# EAGLE design KSZ8851 (EAGLE 7.5.0)
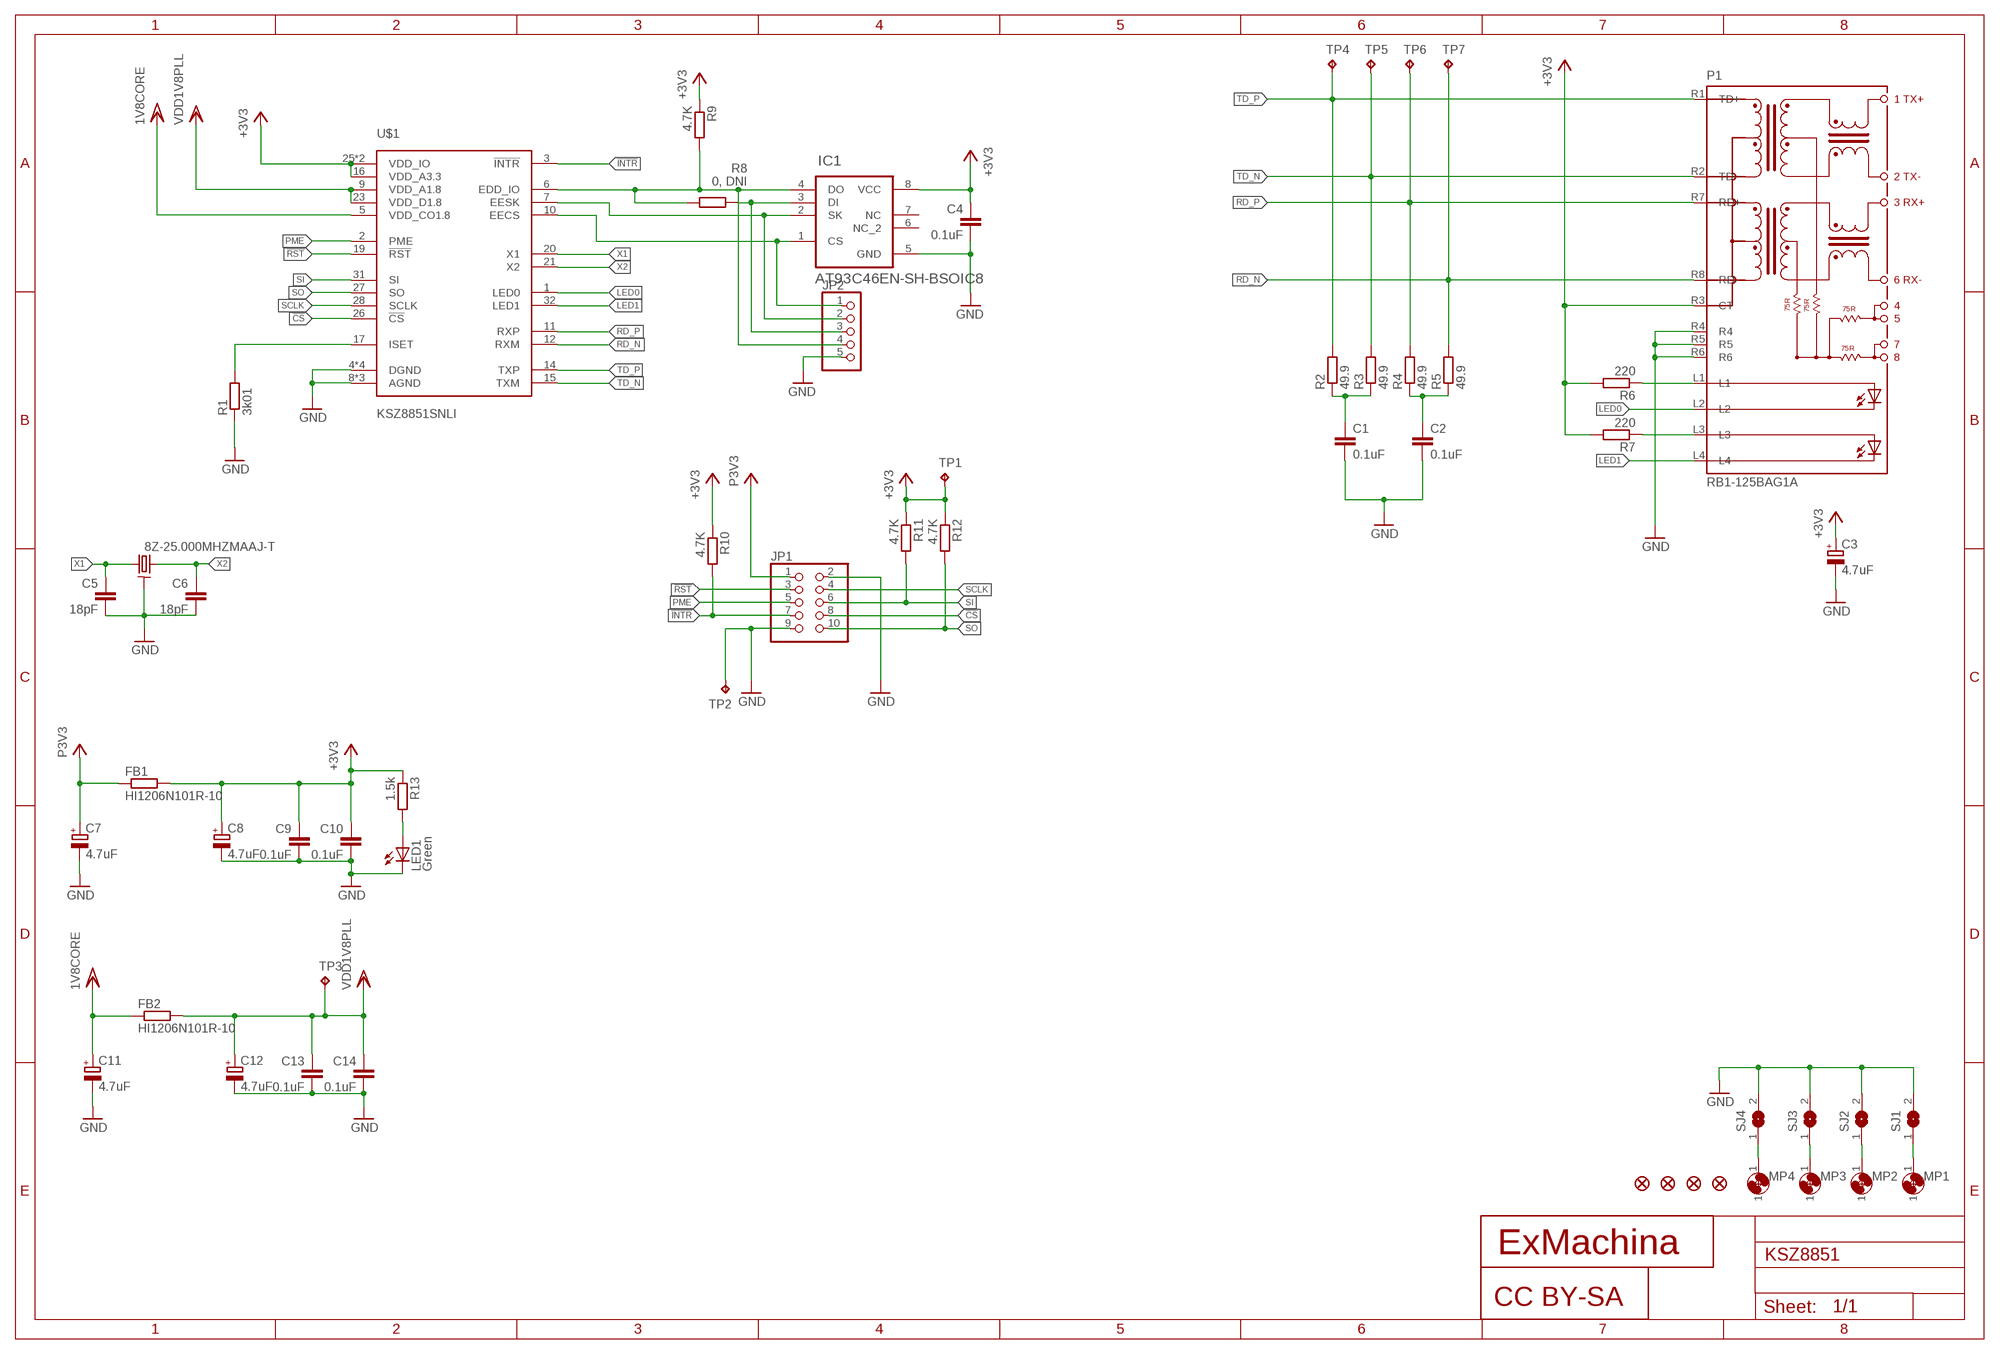
[diagram p0: schematic, sheet 1]

## Parts
-25.000MHZMAAJ-T1  8Z-25.000MHZMAAJ-T  [SMD2.5X2]
C1  0.1uF  C-EUC0603  [C0603]
C2  0.1uF  C-EUC0603  [C0603]
C3  4.7uF  CPOL-EUCT3216  [CT3216]
C4  0.1uF  C-EUC0603  [C0603]
C5  18pF  C-EUC0603  [C0603]
C6  18pF  C-EUC0603  [C0603]
C7  4.7uF  CPOL-EUCT3216  [CT3216]
C8  4.7uF  CPOL-EUCT3216  [CT3216]
C9  0.1uF  C-EUC0603  [C0603]
C10  0.1uF  C-EUC0603  [C0603]
C11  4.7uF  CPOL-EUCT3216  [CT3216]
C12  4.7uF  CPOL-EUCT3216  [CT3216]
C13  0.1uF  C-EUC0603  [C0603]
C14  0.1uF  C-EUC0603  [C0603]
FB1  HI1206N101R-10  [1206]
FB2  HI1206N101R-10  [1206]
IC1  AT93C46EN-SH-BSOIC8  [SOIC8]
JP1  PINHD-2X5  [2X05]
JP2  PINHD-1X55X2MM  [1_05X2MM]
JP3  FIDUCIAL1X2  [FIDUCIAL-1X2]
JP4  FIDUCIAL1X2  [FIDUCIAL-1X2]
JP5  FIDUCIAL1X2  [FIDUCIAL-1X2]
JP6  FIDUCIAL1X2  [FIDUCIAL-1X2]
LED1  Green  LEDSML0603  [SML0603]
MP1  MOUNT-PAD2.5  [P2.5]
MP2  MOUNT-PAD2.5  [P2.5]
MP3  MOUNT-PAD2.5  [P2.5]
MP4  MOUNT-PAD2.5  [P2.5]
P1  RB1-125BAG1A  [WIZNET_RB1-125BAG1A]
R1  3k01  R-EU_R0603  [R0603]
R2  49.9  R-EU_R0603  [R0603]
R3  49.9  R-EU_R0603  [R0603]
R4  49.9  R-EU_R0603  [R0603]
R5  49.9  R-EU_R0603  [R0603]
R6  220  R-EU_R0603  [R0603]
R7  220  R-EU_R0603  [R0603]
R8  0, DNI  R-EU_R0603  [R0603]
R9  4.7K  R-EU_R0603  [R0603]
R10  4.7K  R-EU_R0603  [R0603]
R11  4.7K  R-EU_R0603  [R0603]
R12  4.7K  R-EU_R0603  [R0603]
R13  1.5k  R-EU_R0603  [R0603]
SJ1  SJ  [SJ]
SJ2  SJ  [SJ]
SJ3  SJ  [SJ]
SJ4  SJ  [SJ]
TP1  TPB2,54  [B2,54]
TP2  TPB2,54  [B2,54]
TP3  TPB2,54  [B2,54]
TP4  TPB1,27  [B1,27]
TP5  TPB1,27  [B1,27]
TP6  TPB1,27  [B1,27]
TP7  TPB1,27  [B1,27]
U$1  KSZ8851SNLI  [QFN50P500X500X85-32L]
U$2  EXMACHINA-LOGO-NAME  [EXM-LOGO-BASELINE]
U$3  CC-BY-SA  [CC-BY-SA]

## Nets
1: MP1.1 MP2.1 MP3.1 MP4.1 SJ1.1 SJ2.1 SJ3.1 SJ4.1
!CS: JP1.8 U$1.26(!CS)
!INTR: JP1.7 R10.2 U$1.3(!INTR)
!RST: JP1.3 U$1.19(!RST)
+3V3: C3.+ C4.1 C8.+ C9.1 C10.1 FB1.2 IC1.8(VCC) P1.R3(CT) R6.2 R7.2 R9.1 R10.1 R11.1 R12.1 R13.1 TP1.TP U$1.16(VDD_A3.3) U$1.25(VDD_IO) U$1.30(VDD_IO)
EECS: IC1.1(CS) JP2.1 U$1.10(EECS)
EEDIO: IC1.4(DO) JP2.4 R8.2 R9.2 U$1.6(EDD_IO)
EESK: IC1.2(SK) JP2.2 U$1.7(EESK)
GND: -25.000MHZMAAJ-T1.2 -25.000MHZMAAJ-T1.4 C1.2 C2.2 C3.- C4.2 C5.2 C6.2 C7.- C8.- C9.2 C10.2 C11.- C12.- C13.2 C14.2 IC1.5(GND) JP1.2 JP1.9 JP2.5 LED1.C P1.R4 P1.R5 P1.R6 R1.1 SJ1.2 SJ2.2 SJ3.2 SJ4.2 TP2.TP U$1.4(DGND) U$1.8(AGND) U$1.13(AGND) U$1.18(AGND) U$1.22(DGND) U$1.24(DGND) U$1.29(DGND)
LED0: P1.L2 U$1.1(LED0)
LED1: P1.L4 U$1.32(LED1)
N$1: R1.2 U$1.17(ISET)
N$2: P1.L3 R7.1
N$3: P1.L1 R6.1
N$4: LED1.A R13.2
N$7: C1.1 R2.1 R3.1
N$8: C2.1 R4.1 R5.1
N$9: IC1.3(DI) JP2.3 R8.1
PME: JP1.5 U$1.2(PME)
RD_N: P1.R8(RD-) R5.2 TP7.TP U$1.12(RXM)
RD_P: P1.R7(RD+) R4.2 TP6.TP U$1.11(RXP)
SCLK: JP1.4 U$1.28(SCLK)
SI: JP1.6 R11.2 U$1.31(SI)
SO: JP1.10 R12.2 U$1.27(SO)
TD_N: P1.R2(TD-) R3.2 TP5.TP U$1.15(TXM)
TD_P: P1.R1(TD+) R2.2 TP4.TP U$1.14(TXP)
VCC: C7.+ FB1.1 JP1.1 ; supply symbol labelled P3V3
VCC/2: C11.+ FB2.1 U$1.5(VDD_CO1.8) ; supply symbol labelled 1V8CORE
VDD: C12.+ C13.1 C14.1 FB2.2 TP3.TP U$1.9(VDD_A1.8) U$1.23(VDD_D1.8) ; supply symbol labelled VDD1V8PLL
X1: -25.000MHZMAAJ-T1.1 C5.1 U$1.20(X1)
X2: -25.000MHZMAAJ-T1.3 C6.1 U$1.21(X2)
Unconnected: IC1.6(NC_2) IC1.7(NC)

## Library data of the parts
-25.000MHZMAAJ-T1 = crystal:8Z; MPN: 8Z-25.000MAAJ-T; OC_NEWARK: 84R5794
C1 C2 C4 C9 C10 C13 C14 = rcl:C-EU: CAPACITOR, European symbol; MPN: MC0603B104K160CT; OC_NEWARK: 06R4923
C3 C7 C8 C11 C12 = rcl:CPOL-EU: POLARIZED CAPACITOR, European symbol; MPN: MCCTA475M010; OC_NEWARK: 01M8221
C5 C6 = rcl:C-EU: CAPACITOR, European symbol; MPN: MC0603N180J500CT; OC_NEWARK: 06R5138
FB1 FB2 = emi_filter:HI?N101R-10; MC: LAIRD TECHNOLOGIES; MPN: HI1206N101R-10; OC_FARNELL: 2292367; OC_NEWARK: 66W8861
IC1 = atmel:AT93C46EN-SH-B: Three-wire Serial EEPROM,SOIC-8; MPN: AT93C46EN-SH-T; OC_NEWARK: 68T5247
JP1 = pinhead:PINHD-2X5: PIN HEADER; MPN: M20-9980546; OC_NEWARK: 84K8708
JP2 = pinhead:PINHD-1X5: PIN HEADER; MF: FARNELL; MPN: M22-2010505; OC_NEWARK: 08WX6673
JP3-JP6 = SparkFun:FIDUCIAL: Fiducial Alignment Points Various fiducial points for machine vision alignment.; OC_NEWARK: unknown
LED1 = led:LED: LED OSRAM: - CHIPLED LG R971, LG N971, LY N971, LG Q971, LY Q971, LO R971, LY R971 LH N974, LH R974 LS Q976, LO Q976, LY Q976 LO Q996 - Hyper CHIPLED LW Q18S LB Q993, LB Q99A, LB R99A - SideLED LS A670, LO A670, LY A670, LG A670, LP A670 LB A673, LV A673, LT A673, LW A673 LH A674 LY A675 LS A676, LA A676, LO A676, LY A676, LW A676 LS A679, LY A679, LG A679 - Hyper Micro SIDELED® LS Y876, LA Y876, LO Y876, LY Y876 LT Y87S - SmartLED LW L88C, LW L88S LB L89C, LB L89S, LG L890 LS L89K, LO L89K, LY L89K LS L896, LA L896, LO L896, LY L896 - TOPLED LS T670, LO T670, LY T670, LG T670, LP T670 LSG T670, LSP T670, LSY T670, LOP T670, LYG T670 LG T671, LOG T671, LSG T671 LB T673, LV T673, LT T673, LW T673 LH T674 LS T676, LA T676, LO T676, LY T676, LB T676, LH T676, LSB T676, LW T676 LB T67C, LV T67C, LT T67C, LS T67K, LO T67K, LY T67K, LW E67C LS E67B, LA E67B, LO E67B, LY E67B, LB E67C, LV E67C, LT E67C LW T67C LS T679, LY T679, LG T679 LS T770, LO T770, LY T770, LG T770, LP T770 LB T773, LV T773, LT T773, LW T773 LH T774 LS E675, LA E675, LY E675, LS T675 LS T776, LA T776, LO T776, LY T776, LB T776 LHGB T686 LT T68C, LB T68C - Hyper Mini TOPLED® LB M676 - Mini TOPLED Santana® LG M470 LS M47K, LO M47K, LY M47K Source: http://www.osram.convergy.de LUXEON: - LUMILED® LXK2-PW12-R00, LXK2-PW12-S00, LXK2-PW14-U00, LXK2-PW14-V00 LXK2-PM12-R00, LXK2-PM12-S00, LXK2-PM14-U00 LXK2-PE12-Q00, LXK2-PE12-R00, LXK2-PE12-S00, LXK2-PE14-T00, LXK2-PE14-U00 LXK2-PB12-K00, LXK2-PB12-L00, LXK2-PB12-M00, LXK2-PB14-N00, LXK2-PB14-P00, LXK2-PB14-Q00 LXK2-PR12-L00, LXK2-PR12-M00, LXK2-PR14-Q00, LXK2-PR14-R00 LXK2-PD12-Q00, LXK2-PD12-R00, LXK2-PD12-S00 LXK2-PH12-R00, LXK2-PH12-S00 LXK2-PL12-P00, LXK2-PL12-Q00, LXK2-PL12-R00 Source: www.luxeon.com KINGBRIGHT: KA-3528ASYC Source: www.kingbright.com; MPN: OVS-0604; OC_NEWARK: 15R2206
MP1-MP4 = holes:MOUNT-PAD: MOUNTING HOLE with drill center marker; OC_NEWARK: unknown
P1 = con-wiznet:RB1-125BAG1A: Accessory RJ-45 With Transformer Connector - UDE; OC_NEWARK: unknown
R1 = rcl:R-EU_: RESISTOR, European symbol; MPN: MC0063W060313K01; OC_NEWARK: 94W5780
R2-R5 = rcl:R-EU_: RESISTOR, European symbol; MPN: MC0603SAF499JT5E; OC_NEWARK: 79M5983
R6 R7 = rcl:R-EU_: RESISTOR, European symbol; MF: Multicomp Passives; MPN: MC0063W06031220R; OC_NEWARK: 58K4526
R8 = rcl:R-EU_: RESISTOR, European symbol; MF: Multicomp Passives; MPN: MC0603WG00000T5E-TC; OC_NEWARK: 58K4684
R9-R12 = rcl:R-EU_: RESISTOR, European symbol; MF: Multicomp Passives; MPN: MC0063W060314K7; OC_NEWARK: 58K4608
R13 = rcl:R-EU_: RESISTOR, European symbol; MPN: MCMR06X1501FTL; OC_NEWARK: 86T3542
SJ1-SJ4 = jumper:SJ: SMD solder JUMPER; OC_NEWARK: unknown
TP1-TP7 = testpad:TP: Test pad; OC_NEWARK: unknown
U$1 = Micrel_By_element14_Batch_1:KSZ8851SNL; MPN: KSZ8851SNLI-TR; OC_NEWARK: 72Y5310
U$2 = exmachina:EXMACHINA-LOGO; OC_NEWARK: unknown
U$3 = cc-by-sa:CC-BY-SA; OC_NEWARK: unknown

## Board
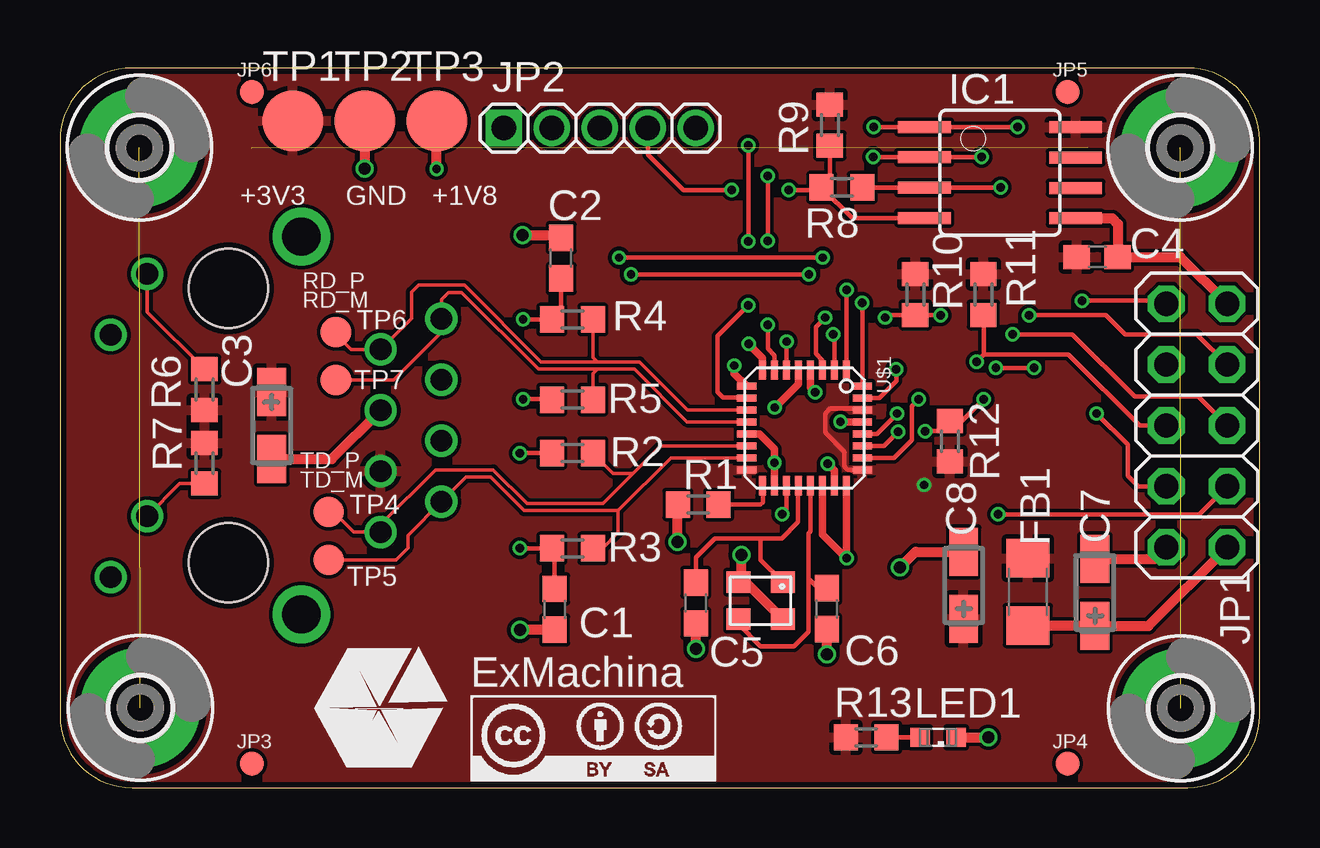
[diagram p1: board, top side]
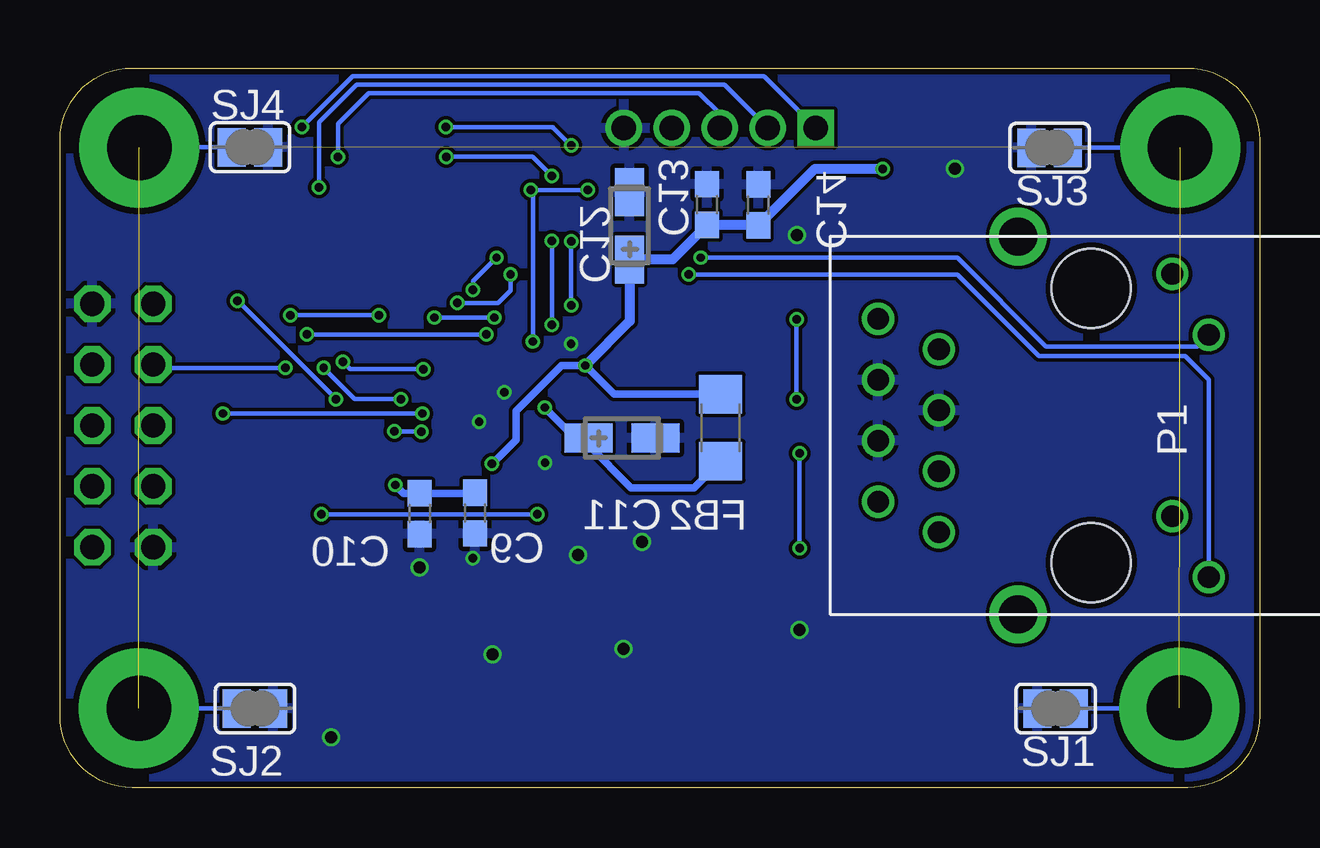
[diagram p2: board, bottom side, seen from below]

Size 50 x 30 mm. Coordinates in mm from the lower left corner, seen from the top.
Outline: 0,27 0,3 arc90 3,0 47,0 arc90 50,3 50,27 arc90 47,30 3,30 arc90 0,27
Copper layers (1*16): Top 0.018mm / dielectric 1.55mm / Bottom 0.018mm
Design rules "eC_2Layer_PClass6_BaseCopperO18_eCDefault *": minimum track width 0.15mm, minimum drill 0.35mm, track to track 0.15mm, track to pad 0.15mm, pad to pad 0.15mm, via to via 0.15mm, smd to smd 0mil, copper to edge 0.25mm, drill to drill 0.35mm, minimum pad ring 0.175mm, minimum via ring 0.125mm, stop-mask expansion 0mil, vias tented up to drill 0.45mm, thermal gap 0.2mm

### Footprints (pad centres in the part's own frame; a part is rotated, then mirrored left to right if it is on the bottom)
SMD2.5X2 = smd 1 x 0.9: 1 -0.925,-0.775; 2 0.925,-0.775; 3 0.925,0.775; 4 -0.925,0.775
C0603 = smd 1.1 x 1: 1 -0.85,0; 2 0.85,0
CT3216 = smd 2 x 1.2: + -1.4,0; - 1.4,0
1206 = smd 1.6 x 1.8: 1 -1.451,0.025; 2 1.349,0.025
SOIC8 = smd 0.5 x 2.2: 1 -1.905,-3.154; 2 -0.645,-3.154; 3 0.625,-3.154; 4 1.895,-3.154; 5 1.905,3.154; 6 0.635,3.154; 7 -0.635,3.154; 8 -1.905,3.154
2X05 = drill 1.016 octagon: 1 -5.08,-1.27; 2 -5.08,1.27; 3 -2.54,-1.27; 4 -2.54,1.27; 5 0,-1.27; 6 0,1.27; 7 2.54,-1.27; 8 2.54,1.27; 9 5.08,-1.27; 10 5.08,1.27
1_05X2MM = drill 1.016 pad 1.3 square: 1 -4,0 | drill 1.016 pad 1.3: 2 0,0; 3 -2,0; 4 2,0; 5 4,0
FIDUCIAL-1X2 = smd 1 x 1: 1 0,0
SML0603 = smd 0.8 x 0.8: A 0.75,0; C -0.75,0
P2.5 = drill 2.7 pad 5: 1 0,0
WIZNET_RB1-125BAG1A = drill 0.9: L1 6.325,-3.38; L2 3.784,-4.899; L3 -3.786,-3.379; L4 -6.325,-4.9 | drill 0.9 pad 1.3: R1 -4.446,6.349; R2 -3.176,8.889; R3 -1.906,6.349; R4 -0.636,8.889; R5 0.634,6.349; R6 1.904,8.889; R7 3.174,6.349; R8 4.444,8.889 | drill 1.6 pad 2.184: S1 -7.876,3.049; S2 7.874,3.049 | hole 3.3: 5.714,-0.001; -5.716,-0.001
R0603 = smd 1 x 1.1: 1 -0.85,0; 2 0.85,0
SJ = smd 1.168 x 1.6: 1 -0.762,0; 2 0.762,0
B2,54 = smd 2.54 x 2.54: TP 0,0
B1,27 = smd 1.27 x 1.27: TP 0,0
QFN50P500X500X85-32L = smd 0.8 x 0.3: 1 -2.41,1.75; 2 -2.41,1.25; 3 -2.41,0.75; 4 -2.41,0.25; 5 -2.41,-0.25; 6 -2.41,-0.75; 7 -2.41,-1.25; 8 -2.41,-1.75; 17 2.41,-1.75; 18 2.41,-1.25; 19 2.41,-0.75; 20 2.41,-0.25; 21 2.41,0.25; 22 2.41,0.75; 23 2.41,1.25; 24 2.41,1.75 | smd 0.3 x 0.8: 9 -1.75,-2.41; 10 -1.25,-2.41; 11 -0.75,-2.41; 12 -0.25,-2.41; 13 0.25,-2.41; 14 0.75,-2.41; 15 1.25,-2.41; 16 1.75,-2.41; 25 1.75,2.41; 26 1.25,2.41; 27 0.75,2.41; 28 0.25,2.41; 29 -0.25,2.41; 30 -0.75,2.41; 31 -1.25,2.41; 32 -1.75,2.41

### Placement (x,y rotation side)
-25.000MHZMAAJ-T1  29.21,7.79 180 top
C1  20.62,7.44 270 top
C2  20.89,22.08 90 top
C3  8.83,15.1 270 top
C4  43.23,22.13 0 top
C5  26.5,7.7 270 top
C6  31.96,7.46 270 top
C7  43.14,8.13 90 top
C8  37.66,8.44 90 top
C9  32.7,11.45 270 bottom
C10  35,11.42 270 bottom
C11  26.58,14.58 0 bottom
C12  26.26,23.42 90 bottom
C13  23.02,24.31 90 bottom
C14  20.89,24.29 90 bottom
FB1  40.37,8.21 90 top
FB2  22.44,15.06 90 bottom
IC1  39.18,25.64 270 top
JP1  47.38,15.1 90 top
JP2  22.5,27.5 0 top
JP3  8,1 0 top
JP4  42,1 0 top
JP5  42,29 0 top
JP6  8,29 0 top
LED1  36.6,2.1 180 top
MP1  3.35,3.33 0 top
MP2  3.31,26.68 0 top
MP3  46.71,3.31 0 top
MP4  46.69,26.68 0 top
P1  7.01,15.1 90 bottom
R1  26.6,11.8 0 top
R2  21.36,13.95 0 top
R3  21.36,9.98 0 top
R4  21.36,19.52 0 top
R5  21.36,16.18 0 top
R6  6.02,16.6 270 top
R7  6.02,13.52 90 top
R8  32.59,25.02 180 top
R9  32.09,27.62 270 top
R10  35.65,20.56 270 top
R11  38.49,20.56 270 top
R12  37.09,14.44 90 top
R13  33.6,2.1 0 top
SJ1  8.5,3.3 180 bottom
SJ2  41.87,3.3 0 bottom
SJ3  8.75,26.68 180 bottom
SJ4  42.08,26.7 0 bottom
TP1  9.7,27.8 0 top
TP2  12.7,27.8 0 top
TP3  15.7,27.8 0 top
TP4  11.2,11.5 0 top
TP5  11.2,9.5 0 top
TP6  11.5,19 0 top
TP7  11.5,17 0 top
U$1  31.04,15 270 top
U$2  13.3,3.3 0 top
U$3  22.4,2.5 0 top

### Tracks (layer width: path | path; a pad name or v marks a point on that pad's centre or on a via)
1  (3 unrouted)
  Bottom 0.178: SJ3.1 MP2.1 | MP1.1 3.38,3.3 SJ1.1 | SJ2.1 MP3.1 | SJ4.1 46.67,26.7 MP4.1
!CS  (via drill 0.35)
  Top 0.178: v39.01,17.5 v40.6,17.5 | v35.8,16.2 35.5,15.9 35.5,14.5 34.75,13.75 U$1.26
  Bottom 0.178: v40.6,17.5 45.97,17.5 JP1.8 | v39.01,17.5 37.71,16.2 v35.8,16.2
!INTR  (via drill 0.35)
  Top 0.178: R10.2 | U$1.3 31.79,17.82 31.5,18.1 31.5,19.2 v31.9,19.6 | v40.4,19.7 43.6,19.7 44.4,18.9 47.39,18.9 JP1.7 | v36.7,19.7 R10.2 | R10.2 34.51,19.71 v34.4,19.6
  Bottom 0.178: v31.9,19.6 v34.4,19.6 | v36.7,19.7 v40.4,19.7
!RST  (via drill 0.35)
  Top 0.178: U$1.19 30.29,11.59 v30.1,11.4 | v39.1,11.4 47.49,11.4 JP1.3
  Bottom 0.178: v30.1,11.4 v39.1,11.4
+3V3  (via drill 0.35)
  Top 0.178: U$1.30 33.4,15.8 32.1,15.8 31.9,15.6 31.9,14.8 32.7,14 32.7,13.4 32.85,13.25 U$1.25
  Bottom 0.305: C9.1 32.73,12.27 C10.1 35.67,12.27 v36.02,12.62
  pour Top (rank 2): -1.27,34.12 -1.27,-1.27 55.88,-1.27 55.88,34.12
EECS  (via drill 0.35)
  Top 0.178: v33.91,27.54 v33.91,27.55 IC1.1 v39.91,27.55 | U$1.10 27.64,16.26 27.4,16.5 27.4,18.82 v28.69,20.11 | v28.69,22.78 v28.69,26.77
  Bottom 0.15: 29.44,27.52 arc45 29.45,27.54
  Bottom 0.178: v28.69,22.78 v28.69,20.11 | 29.45,27.54 v33.91,27.54 | v28.69,26.77 29.44,27.52 | JP2.1 20.66,29.66 37.8,29.66 v39.91,27.55
EEDIO  (via drill 0.35)
  Top 0.178: v30.29,18.6 U$1.6 | IC1.4 33.02,23.75 R8.2 | R8.2 32.09,25.37 R9.2 | R8.2 | JP2.4 24.5,26.4 25.98,24.92 v28,24.92 | R8.2 31.64,24.92 v30.37,24.92
  Bottom 0.178: v28,24.92 v30.37,24.92 30.29,24.84 v30.29,18.6
EESK  (via drill 0.35)
  Top 0.178: v33.9,26.3 33.91,26.29 IC1.2 v38.41,26.29 | v29.5,25.5 v29.5,22.8 | U$1.7 29.79,18.02 29.5,18.3 v29.5,19.3
  Bottom 0.178: v29.5,22.8 v29.5,19.3 | v33.9,26.3 30.3,26.3 v29.5,25.5 | JP2.2 22.5,28.1 23.36,28.96 37.14,28.96 38.41,27.69 v38.41,26.29
GND  (via drill 0.35, 0.5)
  Top 0.305: U$1.8 29.29,17.91 v28.7,18.5 | U$1.13 29.15,14.75 29.78,14.12 v29.78,13.55 U$1.18 | v32.53,15.25 U$1.29 | U$1.4 31.29,16.68 v31.48,16.48 | U$1.22 31.79,10.56 v32.79,9.56 U$1.24
  Top 0.406: 28.58,8.57 28.4,8.75 v28.4,9.7 | v25.74,10.24 R1.1 | C7.- 45.63,9.54 JP1.2 | v31.96,5.56 C6.2 | v26.51,5.78 C5.2 | C3.- 11.33,13.7 P1.R5 | IC1.5 43.87,23.73 44.1,23.5 44.1,22.15 C4.2 46.7,22.13 JP1.9 | v19.29,23.03 20.79,23.03 C2.2 | TP2.TP v12.7,25.8 | v35.01,9.18 35.66,9.84 C8.- | LED1.C v38.7,2.1
  Top 0.407: C1.2 19.19,6.59 v19.17,6.57
  Top 0.408: -25.000MHZMAAJ-T1.2 28.58,8.57 -25.000MHZMAAJ-T1.4
  pour Bottom: -4.11,37.36 -3.81,-3.81 58.42,-3.81 58.12,37.36
LED0  (via drill 0.35)
  Top 0.178: v23.3,22.1 v31.8,22.1 | v32.79,20.76 U$1.1
  Bottom 0.178: P1.L2 2.6,18.4 8.9,18.4 12.6,22.1 v23.3,22.1 | v32.79,20.76 32.79,21.11 v31.8,22.1
LED1  (via drill 0.35)
  Top 0.178: v23.8,21.4 v31.22,21.4 | U$1.32 33.45,18.86 33.44,18.86 v33.44,20.21
  Bottom 0.178: P1.L4 2.12,17.02 3.1,18 9.2,18 12.6,21.4 v23.8,21.4 | v31.22,21.4 31.22,20.73 31.74,20.21 v33.44,20.21
N$1
  Top 0.178: R1.2 29.2,11.8 29.3,11.9 29.3,12.57 U$1.17
N$2
  Top 0.15: P1.L3 5,12.67 R7.1
N$3
  Top 0.15: P1.L1 3.63,19.84 R6.1
N$4
  Top 0.178: R13.2 LED1.A
N$7  (via drill 0.35)
  Top 0.178: C1.1 20.62,9.87 R3.1 v19.18,9.98 v19.17,9.99 | v19.17,13.95 R2.1
  Bottom 0.178: v19.17,9.99 v19.17,13.95
N$8  (via drill 0.35)
  Top 0.178: v19.3,16.2 20.47,16.2 20.49,16.18 R5.1 | v19.3,19.52 R4.1 20.89,19.9 C2.1
  Bottom 0.178: v19.3,16.2 v19.3,19.52
N$9  (via drill 0.35)
  Top 0.178: R8.1 33.45,25.02 IC1.3 36.2,25.02 | v39.2,25.02 36.2,25.02 | 36.2,25.02 35.91,25.02
  Bottom 0.178: JP2.3 22.31,29.31 37.64,29.31 39.2,27.75 v39.2,25.02
PME  (via drill 0.35)
  Top 0.178: v32.23,18.9 32.28,18.84 U$1.2 | v39.7,18.9 42.2,18.9 44.8,16.3 47.45,16.3 JP1.5
  Bottom 0.178: v32.23,18.9 v39.7,18.9
RD_N
  Top 0.15: 22.4,17.45 19.94,17.45 16.74,20.65 16.2,20.65 15.9,20.35 P1.R8 | 22.4,17.45 23.94,17.45 26.14,15.25 U$1.12 | R5.2 22.21,17.26 22.4,17.45 | 15.9,19.3 P1.R8 | TP7.TP 13.9,17 15.9,19 P1.R8
RD_P
  Top 0.15: 22.4,17.75 20.06,17.75 16.86,20.95 14.94,20.95 14.65,20.66 14.65,19.56 P1.R7 12.13,18.27 11.57,18.83 arc-45 TP6.TP | 22.4,17.75 24.16,17.75 26.16,15.75 U$1.11 | R4.2 22.21,17.94 22.4,17.75
SCLK  (via drill 0.35)
  Top 0.178: JP1.4 44.94,12.56 44.5,13 44.5,14.3 v43.2,15.6 | U$1.28 34.05,14.75 v34.9,15.6
  Bottom 0.178: v34.9,15.6 v43.2,15.6
SI  (via drill 0.35)
  Top 0.178: 38.52,18.06 38.52,19.68 R11.2 | JP1.6 45,15.1 42.04,18.06 38.52,18.06 | v38.21,17.75 38.52,18.06 | U$1.31 34.15,16.25 34.86,16.96 v34.86,17.45
  Bottom 0.178: v34.86,17.45 37.91,17.45 v38.21,17.75
SO  (via drill 0.35)
  Top 0.178: v36.07,14.86 36.66,14.86 R12.2 | R12.2 37.09,15.59 | v42.6,20.3 45.99,20.3 JP1.10 | v38.5,16.2 37.59,15.29 R12.2 | U$1.27 34.35,14.25 v34.94,14.84
  Bottom 0.178: v38.5,16.2 v42.6,20.3 | v34.94,14.84 36.05,14.84 v36.07,14.86
TD_N
  Top 0.15: 23.26,11.55 19.34,11.55 17.94,12.95 16.93,12.95 P1.R2 | U$1.15 25.46,13.75 23.26,11.55 | 23.26,11.55 23.26,10.63 22.61,9.98 R3.2 | P1.R2 | P1.R2 14.5,10.52 14.5,10 14,9.5 TP5.TP
TD_P
  Top 0.15: U$1.14 25.04,14.25 23.89,13.11 | R2.2 23.05,13.11 23.89,13.11 | 23.89,13.11 22.64,11.85 19.46,11.85 18.06,13.25 15.65,13.25 13.36,10.96 P1.R1 12.25,10.65 11.4,11.5 TP4.TP
VCC
  Top 0.406: JP1.1 45.37,6.74 C7.+ 40.37,6.74 FB1.1
VCC/2  (via drill 0.35)
  Top 0.305: U$1.5 30.79,16.84 v29.8,15.85
  Bottom 0.305: v29.8,15.85 28.53,14.58 C11.+ 27.98,14.28 26.2,12.5 23.58,12.5 FB2.1
VDD  (via drill 0.35)
  Top 0.305: U$1.23 32.28,13.21 v32,13.5 | v28.1,17.6 28.1,17.27 U$1.9
  Top 0.406: v15.7,25.8 TP3.TP
  Bottom 0.305: v32,13.5 31,14.5 31,15.7 29.1,17.6 v28.1,17.6 26.91,16.41 FB2.2
  Bottom 0.406: v15.7,25.8 18.53,25.8 C14.1 20.9,23.46 C13.1 24.46,22.02 C12.+ 26.26,19.44 v28.1,17.6
X1
  Top 0.178: 29.2,10.4 27.3,10.4 26.5,9.6 C5.1 | 29.2,10.4 30.1,10.4 30.77,11.07 30.77,12.57 U$1.20 | -25.000MHZMAAJ-T1.1 29.2,9.5 29.2,10.4
X2
  Top 0.178: U$1.21 31.29,10.69 31.2,10.6 31.2,9 31.2,8.72 | -25.000MHZMAAJ-T1.3 28.28,6.82 29.2,5.9 30.6,5.9 31.2,6.5 31.2,8.72 | C6.1 31.61,8.31 31.2,8.72

### Text on the board
tPlace: +3V3 | GND | +1V8 | RD_P | RD_M | TD_P | TD_M